# Altium schematic sheet [11] FlashMemory.SchDoc: Flash Memory
size B; DocumentNumber: I; Revision: 01; SheetNumber: 11; SheetTotal: 19
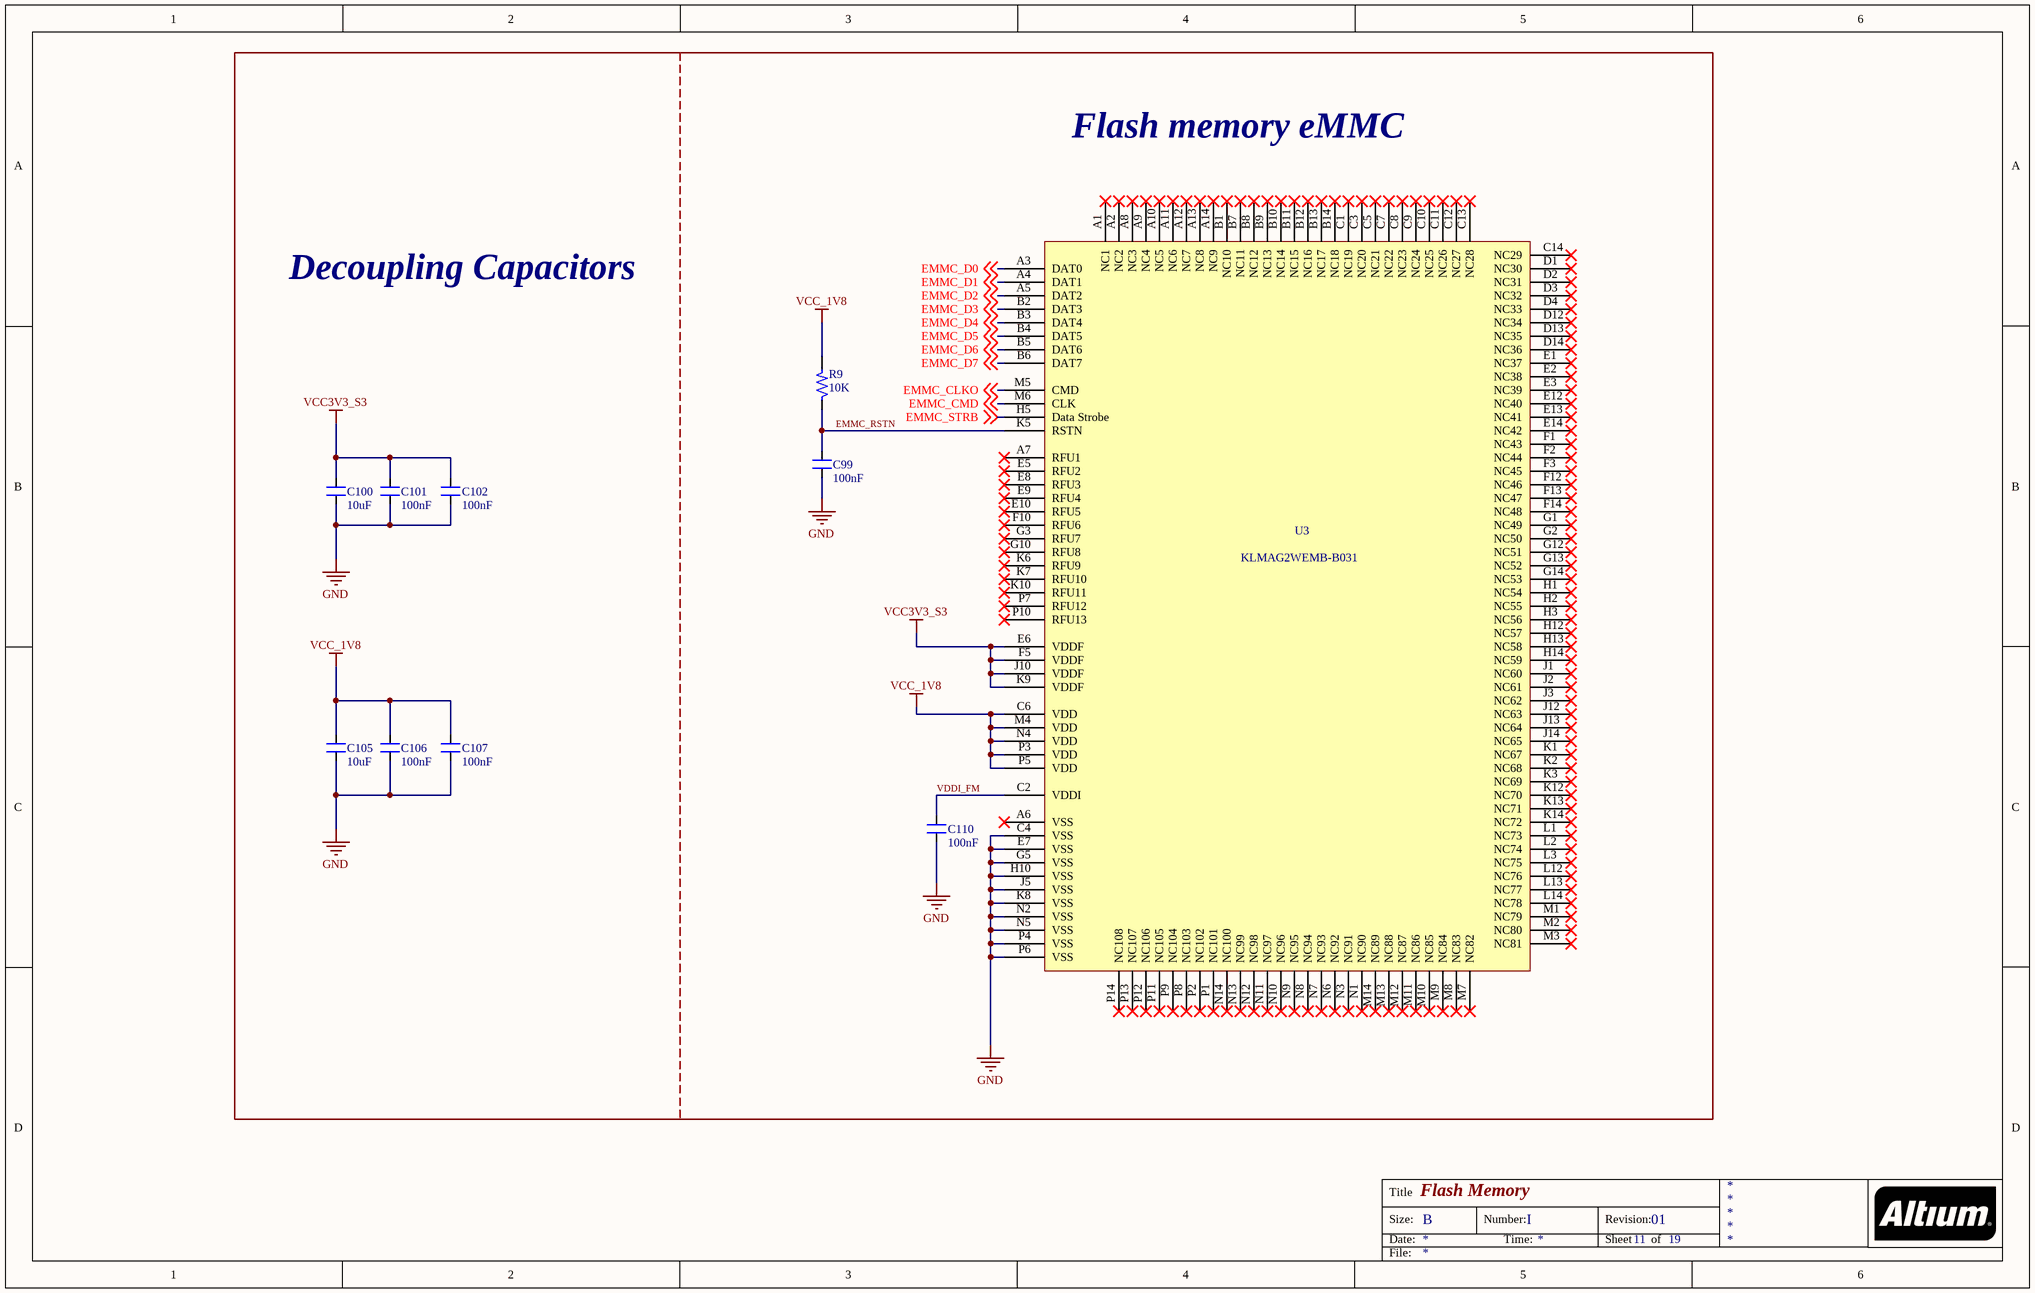
[diagram p0: [11] FlashMemory.SchDoc]

## Parts
C99  100nF  [CAP_0201]
C100  10uF  [CAP_0603]
C101  100nF  [CAP_0201]
C102  100nF  [CAP_0201]
C105  10uF  [CAP_0603]
C106  100nF  [CAP_0201]
C107  100nF  [CAP_0201]
C110  100nF  [CAP_0201]
R9  10K  [RES_0201]
U3  KLMAG2WEMB-B031  [BGA153C50P14X14_1150X1300X70]

## Nets
GND: C99.1 C100.1 C101.1 C102.1 C105.1 C106.1 C107.1 C110.1 U3.C4(VSS) U3.E7(VSS) U3.G5(VSS) U3.H10(VSS) U3.J5(VSS) U3.K8(VSS) U3.N2(VSS) U3.N5(VSS) U3.P4(VSS) U3.P6(VSS)
VCC3V3_S3: C100.2 C101.2 C102.2 U3.E6(VDDF) U3.F5(VDDF) U3.J10(VDDF) U3.K9(VDDF)
VCC_1V8: C105.2 C106.2 C107.2 R9.2 U3.C6(VDD) U3.M4(VDD) U3.N4(VDD) U3.P3(VDD) U3.P5(VDD)
EMMC_CLKO: U3.M5(CMD) ; off-sheet EMMC_CLKO
EMMC_CMD: U3.M6(CLK) ; off-sheet EMMC_CMD
EMMC_D0: U3.A3(DAT0) ; off-sheet EMMC_D0
EMMC_D1: U3.A4(DAT1) ; off-sheet EMMC_D1
EMMC_D2: U3.A5(DAT2) ; off-sheet EMMC_D2
EMMC_D3: U3.B2(DAT3) ; off-sheet EMMC_D3
EMMC_D4: U3.B3(DAT4) ; off-sheet EMMC_D4
EMMC_D5: U3.B4(DAT5) ; off-sheet EMMC_D5
EMMC_D6: U3.B5(DAT6) ; off-sheet EMMC_D6
EMMC_D7: U3.B6(DAT7) ; off-sheet EMMC_D7
EMMC_RSTN: C99.2 R9.1 U3.K5(RSTN)
EMMC_STRB: U3.H5(Data_Strobe) ; off-sheet EMMC_STRB
VDDI_FM: C110.2 U3.C2(VDDI)

Not connected (* = marked no-connect by the designer): U3 A1(NC1)* A2(NC2)* A6(VSS)* A7(RFU1)* A8(NC3)* A9(NC4)* A10(NC5)* A11(NC6)* A12(NC7)* A13(NC8)* A14(NC9)* B1(NC10)* B7(NC11)* B8(NC12)* B9(NC13)* B10(NC14)* B11(NC15)* B12(NC16)* B13(NC17)* B14(NC18)* C1(NC19)* C3(NC20)* C5(NC21)* C7(NC22)* C8(NC23)* C9(NC24)* C10(NC25)* C11(NC26)* C12(NC27)* C13(NC28)* C14(NC29)* D1(NC30)* D2(NC31)* D3(NC32)* D4(NC33)* D12(NC34)* D13(NC35)* D14(NC36)* E1(NC37)* E2(NC38)* E3(NC39)* E5(RFU2)* E8(RFU3)* E9(RFU4)* E10(RFU5)* E12(NC40)* E13(NC41)* E14(NC42)* F1(NC43)* F2(NC44)* F3(NC45)* F10(RFU6)* F12(NC46)* F13(NC47)* F14(NC48)* G1(NC49)* G2(NC50)* G3(RFU7)* G10(RFU8)* G12(NC51)* G13(NC52)* G14(NC53)* H1(NC54)* H2(NC55)* H3(NC56)* H12(NC57)* H13(NC58)* H14(NC59)* J1(NC60)* J2(NC61)* J3(NC62)* J12(NC63)* J13(NC64)* J14(NC65)* K1(NC67)* K2(NC68)* K3(NC69)* K6(RFU9)* K7(RFU10)* K10(RFU11)* K12(NC70)* K13(NC71)* K14(NC72)* L1(NC73)* L2(NC74)* L3(NC75)* L12(NC76)* L13(NC77)* L14(NC78)* M1(NC79)* M2(NC80)* M3(NC81)* M7(NC82)* M8(NC83)* M9(NC84)* M10(NC85)* M11(NC86)* M12(NC87)* M13(NC88)* M14(NC89)* N1(NC90)* N3(NC91)* N6(NC92)* N7(NC93)* N8(NC94)* N9(NC95)* N10(NC96)* N11(NC97)* N12(NC98)* N13(NC99)* N14(NC100)* P1(NC101)* P2(NC102)* P7(RFU12)* P8(NC103)* P9(NC104)* P10(RFU13)* P11(NC105)* P12(NC106)* P13(NC107)* P14(NC108)*

## Notes on the sheet
- Flash memory eMMC
- Decoupling Capacitors
- Title
- Size:
- Date:
- B
- Number:
- Time:
- Revision:
- Sheet
- of
- File:

## Library data of the parts
C99 C101 C102 C106 C107 C110 = CAP_100nF-25V-10%-0201: 0.1µF ±10% 25V Ceramic Capacitor X5R 0201 (0603 Metric) /; Manufacturer: TDK Corporation; Manufacturer Part Number: C0603X5R1E104K030BB; Case/Package: 0201; Supplier-1: Digikey
C100 C105 = CAP_10uF-25V-10%-0603: 10µF ±10% 25V Ceramic Capacitor X5R 0603 (1608 Metric) /; Manufacturer: Murata Electronics; Manufacturer Part Number: GRM188R61E106KA73D; Case/Package: 0603; Supplier-1: Digikey
R9 = RES_10K-0.05W-1%-0201: 10 kOhms ±1% 0.05W, 1/20W Chip Resistor 0201 (0603 Metric) Thick Film /; Manufacturer: Stackpole Electronics Inc; Manufacturer Part Number: RMCF0201FT10K0; Case/Package: 0201; Supplier-1: Digikey
U3 = IC_KLMAG2WEMB-B031: 16GB NAND Flash Memory; Manufacturer: Samsung Electronics; Manufacturer Part Number: KLMAG2WEMB-B031; Case/Package: 153-FBGA; Supplier-1: NA